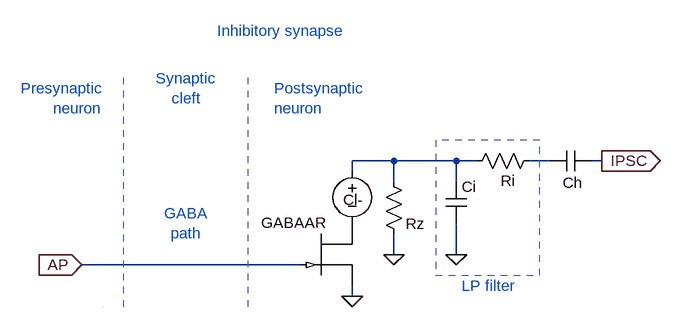
[diagram p0: schematic isyn.asc]
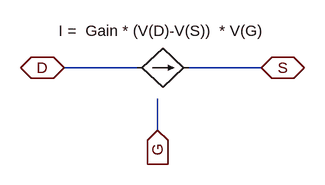
[diagram p1: sub-circuit gabar.asc]
isyn.asc, the LTspice schematic file:
Version 4
SHEET 1 880 964
WIRE -160 -240 -224 -240
WIRE -64 -240 -160 -240
WIRE -32 -240 -64 -240
WIRE 80 -240 48 -240
WIRE 160 -240 144 -240
WIRE -224 -224 -224 -240
WIRE -160 -208 -160 -240
WIRE -64 -208 -64 -240
WIRE -160 -96 -160 -128
WIRE -64 -96 -64 -144
WIRE -304 -80 -640 -80
WIRE -224 -32 -224 -48
FLAG -224 -32 0
FLAG -64 -96 0
FLAG -640 -80 AP
IOPIN -640 -80 In
FLAG 160 -240 IPSC
IOPIN 160 -240 Out
FLAG -160 -96 0
SYMBOL voltage -224 -240 R0
WINDOW 123 0 0 Left 2
WINDOW 39 0 0 Left 2
WINDOW 0 -14 60 Left 2
WINDOW 3 29 23 Invisible 2
SYMATTR InstName Cl-
SYMATTR Value -10mV
SYMBOL cap -80 -208 R0
WINDOW 3 24 56 Invisible 2
SYMATTR Value 100p
SYMATTR InstName Ci
SYMBOL gabar -272 -80 R90
WINDOW 0 -65 -7 VRight 2
SYMATTR InstName GABAAR
SYMATTR SpiceLine Gain=1e-6
SYMBOL cap 144 -256 R90
WINDOW 0 65 29 VBottom 2
WINDOW 3 32 32 Invisible 2
SYMATTR InstName Ch
SYMATTR Value 10n
SYMBOL res 64 -256 R90
WINDOW 0 62 48 VBottom 2
WINDOW 3 32 56 Invisible 2
SYMATTR InstName Ri
SYMATTR Value 1G
SYMBOL res -176 -224 R0
WINDOW 0 34 81 Left 2
WINDOW 3 36 76 Invisible 2
SYMATTR InstName Rz
SYMATTR Value 100Meg
TEXT -56 -48 Left 2 ;LP filter
TEXT -432 -440 Left 2 ;Inhibitory synapse
TEXT -608 -352 Right 2 ;Presynaptic\nneuron
TEXT -344 -352 Left 2 ;Postsynaptic\nneuron
TEXT -480 -352 Center 2 ;Synaptic\ncleft
TEXT -480 -144 Center 2 ;GABA\npath
LINE Normal -576 -16 -576 -368 1
LINE Normal -608 -16 -608 -16 2
LINE Normal -384 -16 -384 -368 1
RECTANGLE Normal 64 -272 -96 -64 1

gabar.asc, the sub-circuit schematic file:
Version 4
SHEET 1 880 680
WIRE 128 112 16 112
WIRE 320 112 208 112
WIRE 160 208 160 160
FLAG 16 112 D
IOPIN 16 112 BiDir
FLAG 160 208 G
IOPIN 160 208 In
FLAG 320 112 S
IOPIN 320 112 BiDir
SYMBOL bi2 208 112 R90
WINDOW 0 50 104 Invisible 2
WINDOW 3 -72 42 VTop 2
SYMATTR InstName B1
SYMATTR Value I =  Gain * (V(D)-V(S))  * V(G)

The netlist it stands for:
* isyn.asc
V§Cl- N001 P001 -10mV
Ci N001 0 100p
XGABAAR P001 AP 0 gabar params: Gain=1e-6
Ch IPSC N002 10n
Ri N002 N001 1G
Rz N001 0 100Meg

* block symbol definitions
.subckt gabar D G S
B1 D S I =  Gain * (V(D)-V(S))  * V(G)
.ends gabar

* LP filter
* Inhibitory synapse
* Presynaptic
* neuron
* Postsynaptic
* neuron
* Synaptic
* cleft
* GABA
* path
.backanno
.end